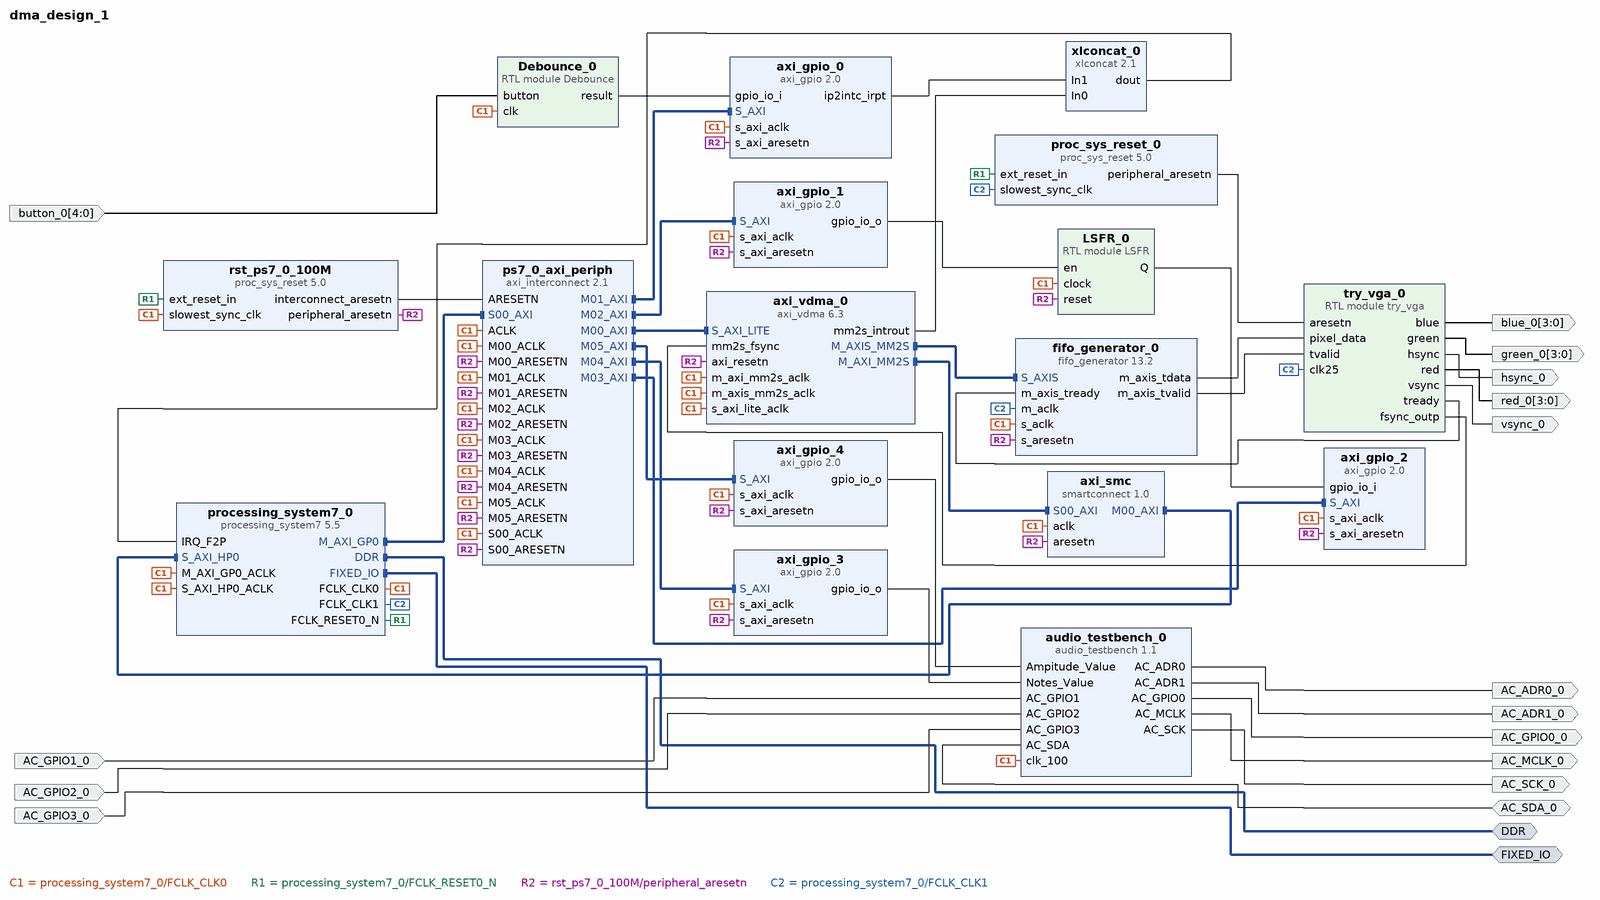
[diagram p0: block diagram of the top level]
# Vivado block design dma_design_1, xc7z020clg484-1, Vivado 2017.3
create_bd_design dma_design_1

create_bd_intf_port -mode Master -vlnv xilinx.com:interface:ddrx_rtl:1.0 DDR
create_bd_intf_port -mode Master -vlnv xilinx.com:display_processing_system7:fixedio_rtl:1.0 FIXED_IO
create_bd_port -dir I -from 4 -to 0 button_0
create_bd_port -dir O AC_ADR0_0
create_bd_port -dir O AC_ADR1_0
create_bd_port -dir O AC_GPIO0_0
create_bd_port -dir I AC_GPIO1_0
create_bd_port -dir I AC_GPIO2_0
create_bd_port -dir I AC_GPIO3_0
create_bd_port -dir O AC_MCLK_0
create_bd_port -dir O AC_SCK_0
create_bd_port -dir IO AC_SDA_0
create_bd_port -dir O hsync_0
create_bd_port -dir O vsync_0
create_bd_port -dir O -from 3 -to 0 red_0
create_bd_port -dir O -from 3 -to 0 green_0
create_bd_port -dir O -from 3 -to 0 blue_0

create_bd_cell -type ip -vlnv xilinx.com:ip:smartconnect:1.0 axi_smc
set_property -dict {CONFIG.NUM_SI 1} [get_bd_cells axi_smc]
create_bd_cell -type ip -vlnv xilinx.com:ip:axi_vdma:6.3 axi_vdma_0
set_property -dict {CONFIG.c_num_fstores 2 CONFIG.c_use_mm2s_fsync 1 CONFIG.c_include_s2mm 0} [get_bd_cells axi_vdma_0]
create_bd_cell -type ip -vlnv xilinx.com:ip:proc_sys_reset:5.0 proc_sys_reset_0
create_bd_cell -type ip -vlnv xilinx.com:ip:processing_system7:5.5 processing_system7_0
set_property -dict [list \
  CONFIG.PCW_UIPARAM_DDR_FREQ_MHZ 533.333313 \
  CONFIG.PCW_APU_PERIPHERAL_FREQMHZ 666.666667 \
  CONFIG.PCW_SDIO_PERIPHERAL_FREQMHZ 50 \
  CONFIG.PCW_UART_PERIPHERAL_FREQMHZ 50 \
  CONFIG.PCW_FPGA0_PERIPHERAL_FREQMHZ 100.000000 \
  CONFIG.PCW_FPGA1_PERIPHERAL_FREQMHZ 40 \
  CONFIG.PCW_USE_S_AXI_HP0 1 \
  CONFIG.PCW_USE_FABRIC_INTERRUPT 1 \
  CONFIG.PCW_EN_CLK1_PORT 1 \
  CONFIG.PCW_IRQ_F2P_INTR 1 \
  CONFIG.PCW_PRESET_BANK1_VOLTAGE {LVCMOS 1.8V} \
  CONFIG.PCW_UIPARAM_DDR_PARTNO {MT41J128M16 HA-15E} \
  CONFIG.PCW_QSPI_PERIPHERAL_ENABLE 1 \
  CONFIG.PCW_QSPI_QSPI_IO {MIO 1 .. 6} \
  CONFIG.PCW_QSPI_GRP_SINGLE_SS_ENABLE 1 \
  CONFIG.PCW_QSPI_GRP_SINGLE_SS_IO {MIO 1 .. 6} \
  CONFIG.PCW_SINGLE_QSPI_DATA_MODE x4 \
  CONFIG.PCW_ENET0_PERIPHERAL_ENABLE 1 \
  CONFIG.PCW_ENET0_ENET0_IO {MIO 16 .. 27} \
  CONFIG.PCW_ENET0_GRP_MDIO_ENABLE 1 \
  CONFIG.PCW_ENET0_GRP_MDIO_IO {MIO 52 .. 53} \
  CONFIG.PCW_ENET_RESET_ENABLE 1 \
  CONFIG.PCW_ENET_RESET_SELECT {Share reset pin} \
  CONFIG.PCW_ENET0_RESET_ENABLE 0 \
  CONFIG.PCW_SD0_PERIPHERAL_ENABLE 1 \
  CONFIG.PCW_SD0_SD0_IO {MIO 40 .. 45} \
  CONFIG.PCW_SD0_GRP_CD_ENABLE 1 \
  CONFIG.PCW_SD0_GRP_CD_IO {MIO 47} \
  CONFIG.PCW_SD0_GRP_WP_ENABLE 1 \
  CONFIG.PCW_SD0_GRP_WP_IO {MIO 46} \
  CONFIG.PCW_UART1_PERIPHERAL_ENABLE 1 \
  CONFIG.PCW_UART1_UART1_IO {MIO 48 .. 49} \
  CONFIG.PCW_TTC0_PERIPHERAL_ENABLE 1 \
  CONFIG.PCW_TTC0_TTC0_IO EMIO \
  CONFIG.PCW_USB0_PERIPHERAL_ENABLE 1 \
  CONFIG.PCW_USB0_USB0_IO {MIO 28 .. 39} \
  CONFIG.PCW_USB_RESET_ENABLE 1 \
  CONFIG.PCW_USB_RESET_SELECT {Share reset pin} \
  CONFIG.PCW_USB0_RESET_ENABLE 0 \
  CONFIG.PCW_I2C_RESET_ENABLE 1 \
  CONFIG.PCW_GPIO_MIO_GPIO_ENABLE 1 \
  CONFIG.PCW_GPIO_MIO_GPIO_IO MIO \
  CONFIG.preset ZedBoard \
  CONFIG.PCW_FPGA_FCLK1_ENABLE 1 \
] [get_bd_cells processing_system7_0]
# 224 more settings of processing_system7_0 are not shown: defaults, MIO pin electricals, DDR timing, and values the tool derives
create_bd_cell -type ip -vlnv xilinx.com:ip:axi_interconnect:2.1 ps7_0_axi_periph
set_property -dict {CONFIG.NUM_MI 6} [get_bd_cells ps7_0_axi_periph]
create_bd_cell -type ip -vlnv xilinx.com:ip:proc_sys_reset:5.0 rst_ps7_0_100M
create_bd_cell -type ip -vlnv xilinx.com:ip:xlconcat:2.1 xlconcat_0
create_bd_cell -type ip -vlnv xilinx.com:ip:axi_gpio:2.0 axi_gpio_0
set_property -dict [list \
  CONFIG.C_GPIO_WIDTH 5 \
  CONFIG.C_IS_DUAL 0 \
  CONFIG.C_ALL_INPUTS 1 \
  CONFIG.C_INTERRUPT_PRESENT 1 \
  CONFIG.USE_BOARD_FLOW true \
  CONFIG.GPIO_BOARD_INTERFACE Custom \
] [get_bd_cells axi_gpio_0]
create_bd_cell -type ip -vlnv xilinx.com:ip:axi_gpio:2.0 axi_gpio_1
set_property -dict [list \
  CONFIG.C_GPIO_WIDTH 1 \
  CONFIG.C_IS_DUAL 0 \
  CONFIG.C_ALL_INPUTS 0 \
  CONFIG.C_ALL_OUTPUTS 1 \
] [get_bd_cells axi_gpio_1]
create_bd_cell -type ip -vlnv xilinx.com:ip:axi_gpio:2.0 axi_gpio_2
set_property -dict {CONFIG.C_GPIO_WIDTH 8 CONFIG.C_ALL_INPUTS 1} [get_bd_cells axi_gpio_2]
create_bd_cell -type ip -vlnv xilinx.com:ip:axi_gpio:2.0 axi_gpio_3
set_property -dict {CONFIG.C_GPIO_WIDTH 8 CONFIG.C_ALL_OUTPUTS 1} [get_bd_cells axi_gpio_3]
create_bd_cell -type ip -vlnv xilinx.com:ip:axi_gpio:2.0 axi_gpio_4
set_property -dict {CONFIG.C_GPIO_WIDTH 24 CONFIG.C_ALL_OUTPUTS 1} [get_bd_cells axi_gpio_4]
create_bd_cell -type module -reference LSFR LSFR_0
create_bd_cell -type module -reference Debounce Debounce_0
create_bd_cell -type ip -vlnv sfu.ca:user:audio_testbench:1.1 audio_testbench_0
create_bd_cell -type ip -vlnv xilinx.com:ip:fifo_generator:13.2 fifo_generator_0
set_property -dict [list \
  CONFIG.INTERFACE_TYPE AXI_STREAM \
  CONFIG.Full_Flags_Reset_Value 1 \
  CONFIG.Clock_Type_AXI Independent_Clock \
  CONFIG.TDATA_NUM_BYTES 4 \
  CONFIG.TUSER_WIDTH 0 \
  CONFIG.FIFO_Implementation_wach Independent_Clocks_Distributed_RAM \
  CONFIG.FIFO_Implementation_wdch Independent_Clocks_Block_RAM \
  CONFIG.FIFO_Implementation_wrch Independent_Clocks_Distributed_RAM \
  CONFIG.FIFO_Implementation_rach Independent_Clocks_Distributed_RAM \
  CONFIG.FIFO_Implementation_rdch Independent_Clocks_Block_RAM \
  CONFIG.FIFO_Implementation_axis Independent_Clocks_Block_RAM \
  CONFIG.Enable_Safety_Circuit true \
] [get_bd_cells fifo_generator_0]
create_bd_cell -type module -reference try_vga try_vga_0

# ---- connections ----

connect_bd_intf_net [get_bd_intf_pins axi_smc/M00_AXI] [get_bd_intf_pins processing_system7_0/S_AXI_HP0]
connect_bd_intf_net [get_bd_intf_pins axi_smc/S00_AXI] [get_bd_intf_pins axi_vdma_0/M_AXI_MM2S]
connect_bd_intf_net [get_bd_intf_pins processing_system7_0/M_AXI_GP0] [get_bd_intf_pins ps7_0_axi_periph/S00_AXI]
connect_bd_intf_net [get_bd_intf_pins axi_vdma_0/S_AXI_LITE] [get_bd_intf_pins ps7_0_axi_periph/M00_AXI]
connect_bd_intf_net [get_bd_intf_pins ps7_0_axi_periph/M01_AXI] [get_bd_intf_pins axi_gpio_0/S_AXI]
connect_bd_intf_net [get_bd_intf_pins ps7_0_axi_periph/M02_AXI] [get_bd_intf_pins axi_gpio_1/S_AXI]
connect_bd_intf_net [get_bd_intf_pins ps7_0_axi_periph/M03_AXI] [get_bd_intf_pins axi_gpio_2/S_AXI]
connect_bd_intf_net [get_bd_intf_pins axi_gpio_3/S_AXI] [get_bd_intf_pins ps7_0_axi_periph/M04_AXI]
connect_bd_intf_net [get_bd_intf_pins axi_gpio_4/S_AXI] [get_bd_intf_pins ps7_0_axi_periph/M05_AXI]
connect_bd_intf_net [get_bd_intf_pins axi_vdma_0/M_AXIS_MM2S] [get_bd_intf_pins fifo_generator_0/S_AXIS]
connect_bd_intf_net [get_bd_intf_ports DDR] [get_bd_intf_pins processing_system7_0/DDR]
connect_bd_intf_net [get_bd_intf_ports FIXED_IO] [get_bd_intf_pins processing_system7_0/FIXED_IO]
connect_bd_net [get_bd_pins axi_vdma_0/mm2s_introut] [get_bd_pins xlconcat_0/In0]
connect_bd_net [get_bd_pins processing_system7_0/FCLK_CLK0] \
  [get_bd_pins axi_smc/aclk] [get_bd_pins axi_vdma_0/m_axi_mm2s_aclk] [get_bd_pins axi_vdma_0/s_axi_lite_aclk] \
  [get_bd_pins processing_system7_0/M_AXI_GP0_ACLK] [get_bd_pins processing_system7_0/S_AXI_HP0_ACLK] \
  [get_bd_pins rst_ps7_0_100M/slowest_sync_clk] [get_bd_pins axi_gpio_0/s_axi_aclk] [get_bd_pins axi_gpio_1/s_axi_aclk] \
  [get_bd_pins axi_gpio_2/s_axi_aclk] [get_bd_pins axi_gpio_3/s_axi_aclk] [get_bd_pins axi_gpio_4/s_axi_aclk] \
  [get_bd_pins LSFR_0/clock] [get_bd_pins Debounce_0/clk] [get_bd_pins audio_testbench_0/clk_100] \
  [get_bd_pins fifo_generator_0/s_aclk] [get_bd_pins axi_vdma_0/m_axis_mm2s_aclk] [get_bd_pins ps7_0_axi_periph/ACLK] \
  [get_bd_pins ps7_0_axi_periph/M00_ACLK] [get_bd_pins ps7_0_axi_periph/S00_ACLK] [get_bd_pins ps7_0_axi_periph/M01_ACLK] \
  [get_bd_pins ps7_0_axi_periph/M02_ACLK] [get_bd_pins ps7_0_axi_periph/M03_ACLK] [get_bd_pins ps7_0_axi_periph/M04_ACLK] \
  [get_bd_pins ps7_0_axi_periph/M05_ACLK]
connect_bd_net [get_bd_pins processing_system7_0/FCLK_RESET0_N] [get_bd_pins proc_sys_reset_0/ext_reset_in] [get_bd_pins rst_ps7_0_100M/ext_reset_in]
connect_bd_net [get_bd_pins rst_ps7_0_100M/interconnect_aresetn] [get_bd_pins ps7_0_axi_periph/ARESETN]
connect_bd_net [get_bd_pins rst_ps7_0_100M/peripheral_aresetn] \
  [get_bd_pins axi_smc/aresetn] [get_bd_pins axi_vdma_0/axi_resetn] [get_bd_pins axi_gpio_0/s_axi_aresetn] \
  [get_bd_pins axi_gpio_1/s_axi_aresetn] [get_bd_pins axi_gpio_2/s_axi_aresetn] [get_bd_pins axi_gpio_3/s_axi_aresetn] \
  [get_bd_pins axi_gpio_4/s_axi_aresetn] [get_bd_pins LSFR_0/reset] [get_bd_pins fifo_generator_0/s_aresetn] \
  [get_bd_pins ps7_0_axi_periph/M00_ARESETN] [get_bd_pins ps7_0_axi_periph/S00_ARESETN] \
  [get_bd_pins ps7_0_axi_periph/M01_ARESETN] [get_bd_pins ps7_0_axi_periph/M02_ARESETN] \
  [get_bd_pins ps7_0_axi_periph/M03_ARESETN] [get_bd_pins ps7_0_axi_periph/M04_ARESETN] \
  [get_bd_pins ps7_0_axi_periph/M05_ARESETN]
connect_bd_net [get_bd_pins xlconcat_0/dout] [get_bd_pins processing_system7_0/IRQ_F2P]
connect_bd_net [get_bd_pins axi_gpio_0/ip2intc_irpt] [get_bd_pins xlconcat_0/In1]
connect_bd_net [get_bd_pins axi_gpio_1/gpio_io_o] [get_bd_pins LSFR_0/en]
connect_bd_net [get_bd_pins LSFR_0/Q] [get_bd_pins axi_gpio_2/gpio_io_i]
connect_bd_net [get_bd_pins Debounce_0/result] [get_bd_pins axi_gpio_0/gpio_io_i]
connect_bd_net -net button_0_1 [get_bd_ports button_0] [get_bd_pins Debounce_0/button]
connect_bd_net [get_bd_pins axi_gpio_3/gpio_io_o] [get_bd_pins audio_testbench_0/Notes_Value]
connect_bd_net [get_bd_pins axi_gpio_4/gpio_io_o] [get_bd_pins audio_testbench_0/Ampitude_Value]
connect_bd_net [get_bd_pins audio_testbench_0/AC_ADR0] [get_bd_ports AC_ADR0_0]
connect_bd_net [get_bd_pins audio_testbench_0/AC_ADR1] [get_bd_ports AC_ADR1_0]
connect_bd_net [get_bd_pins audio_testbench_0/AC_GPIO0] [get_bd_ports AC_GPIO0_0]
connect_bd_net -net AC_GPIO1_0_1 [get_bd_ports AC_GPIO1_0] [get_bd_pins audio_testbench_0/AC_GPIO1]
connect_bd_net -net AC_GPIO2_0_1 [get_bd_ports AC_GPIO2_0] [get_bd_pins audio_testbench_0/AC_GPIO2]
connect_bd_net -net AC_GPIO3_0_1 [get_bd_ports AC_GPIO3_0] [get_bd_pins audio_testbench_0/AC_GPIO3]
connect_bd_net [get_bd_pins audio_testbench_0/AC_MCLK] [get_bd_ports AC_MCLK_0]
connect_bd_net [get_bd_pins audio_testbench_0/AC_SCK] [get_bd_ports AC_SCK_0]
connect_bd_net [get_bd_ports AC_SDA_0] [get_bd_pins audio_testbench_0/AC_SDA]
connect_bd_net [get_bd_pins try_vga_0/hsync] [get_bd_ports hsync_0]
connect_bd_net [get_bd_pins try_vga_0/vsync] [get_bd_ports vsync_0]
connect_bd_net [get_bd_pins try_vga_0/red] [get_bd_ports red_0]
connect_bd_net [get_bd_pins try_vga_0/green] [get_bd_ports green_0]
connect_bd_net [get_bd_pins try_vga_0/blue] [get_bd_ports blue_0]
connect_bd_net [get_bd_pins try_vga_0/fsync_outp] [get_bd_pins axi_vdma_0/mm2s_fsync]
connect_bd_net [get_bd_pins fifo_generator_0/m_axis_tdata] [get_bd_pins try_vga_0/pixel_data]
connect_bd_net [get_bd_pins try_vga_0/tready] [get_bd_pins fifo_generator_0/m_axis_tready]
connect_bd_net [get_bd_pins fifo_generator_0/m_axis_tvalid] [get_bd_pins try_vga_0/tvalid]
connect_bd_net [get_bd_pins processing_system7_0/FCLK_CLK1] \
  [get_bd_pins proc_sys_reset_0/slowest_sync_clk] [get_bd_pins fifo_generator_0/m_aclk] [get_bd_pins try_vga_0/clk25]
connect_bd_net [get_bd_pins proc_sys_reset_0/peripheral_aresetn] [get_bd_pins try_vga_0/aresetn]

# ---- address map ----
assign_bd_address -offset 0x00000000 -range 512M -target_address_space [get_bd_addr_spaces axi_vdma_0/Data_MM2S] [get_bd_addr_segs processing_system7_0/S_AXI_HP0/HP0_DDR_LOWOCM]
assign_bd_address -offset 0x41200000 -range 64K -target_address_space [get_bd_addr_spaces processing_system7_0/Data] [get_bd_addr_segs axi_gpio_0/S_AXI/Reg]
assign_bd_address -offset 0x41210000 -range 64K -target_address_space [get_bd_addr_spaces processing_system7_0/Data] [get_bd_addr_segs axi_gpio_1/S_AXI/Reg]
assign_bd_address -offset 0x41220000 -range 64K -target_address_space [get_bd_addr_spaces processing_system7_0/Data] [get_bd_addr_segs axi_gpio_2/S_AXI/Reg]
assign_bd_address -offset 0x41230000 -range 64K -target_address_space [get_bd_addr_spaces processing_system7_0/Data] [get_bd_addr_segs axi_gpio_3/S_AXI/Reg]
assign_bd_address -offset 0x41240000 -range 64K -target_address_space [get_bd_addr_spaces processing_system7_0/Data] [get_bd_addr_segs axi_gpio_4/S_AXI/Reg]
assign_bd_address -offset 0x43000000 -range 64K -target_address_space [get_bd_addr_spaces processing_system7_0/Data] [get_bd_addr_segs axi_vdma_0/S_AXI_LITE/Reg]

validate_bd_design
save_bd_design
